# Altium project Capstone_board.PrjPcb
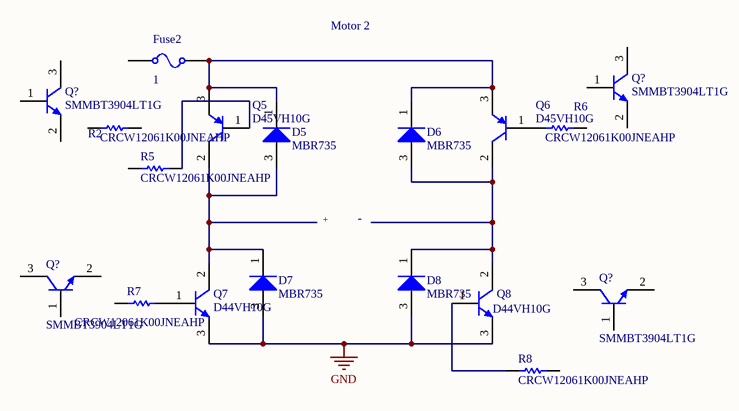
[diagram p0: H-Bridge.SchDoc]
2 sheets, 18 parts. Net scope: global (net labels, ports and power ports of the same name join across sheets).
Board file: PCB1_R1_V1.PcbDoc
Sheets:
  ESP32-S3_dev_board.SchDoc
  H-Bridge.SchDoc

## Sheet ESP32-S3_dev_board.SchDoc
size A; SheetNumber: 1; SheetTotal: 1

## Sheet H-Bridge.SchDoc
size A; SheetNumber: 2; SheetTotal: 2

### Parts
(Parts that share a designator on the sheet are numbered #1, #2 ... from top to bottom, then left to right.)
D5  MBR735  [ONSC-TO-220-2-221B-04_E]
D6  MBR735  [ONSC-TO-220-2-221B-04_E]
D7  MBR735  [ONSC-TO-220-2-221B-04_E]
D8  MBR735  [ONSC-TO-220-2-221B-04_E]
Fuse2  CURRENT: 1  (hidden comment: Fuse)
Q5  D45VH10G  [ONSC-TO-220-3-221A-09]
Q6  D45VH10G  [ONSC-TO-220-3-221A-09]
Q7  D44VH10G  [ONSC-TO-220-3-221A-09]
Q8  D44VH10G  [ONSC-TO-220-3-221A-09]
Q?#1  SMMBT3904LT1G  [ONSC-SOT-23-3-318-08_V]
Q?#2  SMMBT3904LT1G  [ONSC-SOT-23-3-318-08_V]
Q?#3  SMMBT3904LT1G  [ONSC-SOT-23-3-318-08_V]
Q?#4  SMMBT3904LT1G  [ONSC-SOT-23-3-318-08_V]
R2  CRCW12061K00JNEAHP  [RESC3116X65X50LL20T20]
R5  CRCW12061K00JNEAHP  [RESC3116X65X50LL20T20]
R6  CRCW12061K00JNEAHP  [RESC3116X65X50LL20T20]
R7  CRCW12061K00JNEAHP  [RESC3116X65X50LL20T20]
R8  CRCW12061K00JNEAHP  [RESC3116X65X50LL20T20]

### Nets
GND: D7.3(A) D8.3(A) Q7.3(E) Q8.3(E)
NetD5_1: D5.1(K) D6.1(K) Fuse2.2 Q5.3(E) Q6.3(E)
NetD5_3: D5.3(A) D7.1(K) Q5.2(C) Q7.2(C)
NetD6_3: D6.3(A) D8.1(K) Q6.2(C) Q8.2(C)
NetQ5_1: Q5.1(B) R5.2
NetQ6_1: Q6.1(B) R6.1
NetQ7_1: Q7.1(B) R7.2
NetQ8_1: Q8.1(B) R8.1

Not connected (* = marked no-connect by the designer): Fuse2 1; Q?#1 1(B) 2(E) 3(C); Q?#2 1(B) 2(E) 3(C); Q?#3 1(B) 2(E) 3(C); Q?#4 1(B) 2(E) 3(C); R2 1 2; R5 1; R6 2; R7 1; R8 2

### Notes on the sheet
- Motor 2
- +
- -

### Library data of the parts
D5-D8 = CMP-1055-00595-1: SWITCHMODE(TM) Power Rectifier, 2-Pin TO-220, Tube; Manufacturer: On Semiconductor; IFSM Max (A): 150; Configuration: Single; ComponentLink3URL: http://www.onsemi.com/pub_link/Collateral/BYW29-D.PDF; ComponentLink1URL: http://www.onsemi.com/; Mounting Technology: Through Hole; PartNumber: MBR735; PackageDescription: 2-Pin Flange Mount, Vertical Straight Lead, Body 9.97 x 4.44 mm, Pitch 5.08 mm; DatasheetVersion: Rev. 8; PackageReference: TO-220-2-221B-04_E; RoHS: FALSE; ComponentLink2URL: http://www.onsemi.cn/pub_link/Collateral/MBR735-D.PDF; PackageVersion: Rev. E; ComponentLink3Description: Package Specification; ComponentLink1Description: Manufacturer URL; Packing: Tube; ComponentLink2Description: Datasheet
Fuse2 = Fuse: RESISTANCE: 1m; SimulationGenericComponent: True
Q5 Q6 = CMP-1048-01180-1: Complementary Silicon Power Transistor, 3-Pin TO-220, Pb-Free, Tube; Manufacturer: On Semiconductor; Polarity: PNP; IC Continuous (A): 15; RoHS: TRUE; Packing: Tube; PackageReference: TO-220-3-221A-09; ComponentLink1URL: http://www.onsemi.com/; ComponentLink1Description: Manufacturer URL; ComponentLink3Description: Package Specification; PackageVersion: Rev. AG, 09/2011; ComponentLink2Description: Datasheet; ComponentLink3URL: http://www.onsemi.com/pub_link/Collateral/221A-09.PDF; PackageDescription: 3-Pin Flange Mount, Vertical Straight Lead, Body 9.97 x 4.445 mm, Pitch 2.54 mm; Mounting Technology: Through Hole; PartNumber: D45VH10G; ComponentLink2URL: http://www.onsemi.com/pub_link/Collateral/D44VH-D.PDF; DatasheetVersion: Rev. 7
Q7 Q8 = CMP-1048-01173-1: Complementary Silicon Power Transistor, 3-Pin TO-220, Pb-Free, Tube; Manufacturer: On Semiconductor; IC Continuous (A): 15; Polarity: NPN; Mounting Technology: Through Hole; ComponentLink1URL: http://www.onsemi.com/; PartNumber: D44VH10G; Packing: Tube; ComponentLink3Description: Package Specification; ComponentLink1Description: Manufacturer URL; ComponentLink3URL: http://www.onsemi.com/pub_link/Collateral/221A-09.PDF; PackageDescription: 3-Pin Flange Mount, Vertical Straight Lead, Body 9.97 x 4.445 mm, Pitch 2.54 mm; PackageReference: TO-220-3-221A-09; ComponentLink2Description: Datasheet; DatasheetVersion: Rev. 7; RoHS: TRUE; ComponentLink2URL: http://www.onsemi.com/pub_link/Collateral/D44VH-D.PDF; PackageVersion: Rev. AG, 09/2011
Q?#1-Q?#4 = CMP-1048-00625-1: General Purpose Transistor, NPN Silicon, 3-Pin SOT-23, Pb-Free, Tape and Reel; Manufacturer: On Semiconductor; IC Continuous (A): 0.2; fT Min (MHz): 300; PackageDescription: 3-Pin Small Outline Transistor, Body 2.92 x 1.3 mm, Pitch 0.95 mm; Mounting Technology: Surface Mount; ComponentLink1Description: Manufacturer URL; DatasheetVersion: Rev. 12; PackageReference: SOT-23-3-318-08; ComponentLink1URL: http://www.onsemi.com/; ComponentLink3Description: Package Specification; RoHS: TRUE; PartNumber: SMMBT3904LT1G; Polarity: NPN; Packing: Tape and Reel; ComponentLink2URL: http://www.onsemi.cn/pub_link/Collateral/MMBT3904LT1-D.PDF; PackageVersion: Rev. AP, 11/2009; ComponentLink2Description: Datasheet; ComponentLink3URL: http://www.onsemi.cn/pub_link/Collateral/318-08.PDF
R2 R5-R8 = CMP-2003-04880-1: Manufacturer: Vishay Dale; Part Number: CRCW12061K00JNEAHP